# Altium schematic sheet power_supply_v2.SchDoc
size A
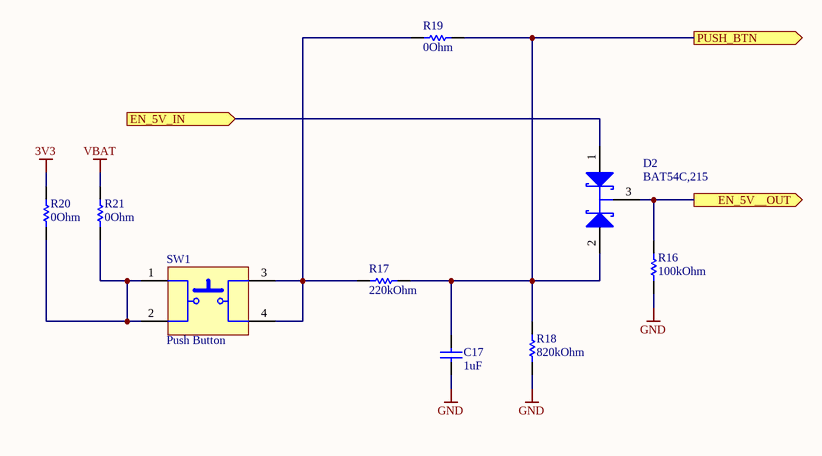
[diagram p0: power_supply_v2.SchDoc]

## Parts
C17  1uF  [CAP_0804]
D2  BAT54C,215  [SOT23]
R16  100kOhm  [RES_0804]
R17  220kOhm  [RES_0804]
R18  820kOhm  [RES_0804]
R19  0Ohm  [RES_0804]
R20  0Ohm  [RES_0804]
R21  0Ohm  [RES_0804]
SW1  Push Button  [SWITCH]

## Ports
EN_5V__OUT (out), EN_5V_IN (in), PUSH_BTN (out)

## Nets
3V3: R20.2
GND: C17.1 R16.1 R18.1
VBAT: R21.2
EN_5V__OUT: D2.3(K) R16.2 ; port EN_5V__OUT
EN_5V_IN: D2.1(A) ; port EN_5V_IN
PUSH_BTN: C17.2 D2.2(A) R17.2 R18.2 R19.2 ; port PUSH_BTN
NetR17_1: R17.1 R19.1 SW1.3 SW1.4
NetR20_1: R20.1 R21.1 SW1.1 SW1.2

## Library data of the parts
C17 = CAP_1UF: PartNumber: 1206GC102KAT1A; Manufacturer: AVX; Capacitance: 0.001uF; Dielectric: X7R; Tolerance: 10%; Tolerance (%): ±10%; Voltage Rating DC: 2000V; Package Reference: 1206; Datasheet Version: 11/2010; Mounting Technology: SurfaceMount; Manufacturer URL: http://www.avx.com/; Datasheet URL: https://datasheet.ciiva.com/11787/0900766b80ed4c37-11787781.pdf; Package Description: 2-Pin SMD, Body 3.4 x 1.8 mm; Case Size/Dimension: 1206; Rated Voltage: 2000V
D2 = DIODE_BAT54C: Schottky Barrier Diode, 30 V, 3-Pin SOT23, RoHS, Tape and Reel; Manufacturer: NXP Semiconductors; Forward Surge Current Ifsm Max: 600mA; Pin Configuration: 1A1,2A2,3comK; Package Version: Feb-16; Forward Voltage VF Max: 800mV; SMD Marking: L43/*W1; Diode Case Style: SOT-23; Reverse Recovery Time trr Typ: 5ns; Forward Current If(AV): 200mA; Reel Quantity: 3000; SVHC: NoSVHC(19-Dec-2012); No. of Pins: 3; Junction Temperature Tj Max: 125degC; Common Connection: Cathode; Repetitive Reverse Voltage Vrrm Max: 30V; Operating Temperature Max: 150degC; Operating Temperature Range: -65degCto+150degC; Termination Type: SMD; Package Description: 3-Pin Small Outline Transistor, Body 1.3 x 2.9 mm, Pitch 0.95 mm; Package / Case: SOT-23; Diode Type: Schottky; Manufacturer URL: http://www.nxp.com/; Tape Width: 8mm; Package Reference: SOT23-3; Datasheet URL: https://datasheet.ciiva.com/33723/1668625-33723936.pdf; Datasheet Version: Rev. 5 , 10/2012; Operating Temperature Min: -65degC; Current Ifsm: 600mA; Reverse Recovery Time trr Max: 5ns; Package URL: http://www.nxp.com/documents/outline_drawing/SOT23.pdf; Forward Voltage: 800mV
R16 = RES_100K: Part Number: CRCW120647K0FKEA; Manufacturer: Vishay Dale
R17 = RES_220K: Part Number: CRCW120647K0FKEA; Manufacturer: Vishay Dale
R18 = RES_820K: Part Number: CRCW120647K0FKEA; Manufacturer: Vishay Dale
R19-R21 = RES_0R: Part Number: CRCW120647K0FKEA; Manufacturer: Vishay Dale
SW1 = SWITCH: Micro Miniature Push Button Switch FSM JSM, 50 mA, -35 to 85 degC, 4-Pin SMD, RoHS, Tape and Reel; Manufacturer: TE Connectivity; Mechanical Life: 100000Cycles; Current Rating: 50mA; Actuator Material: Polyamide; Max Voltage Rating (DC): 12V; Capacitance: 0f; Illumination Type: Illuminated; Voltage Rating (DC): 24V; Case\/Package: SMD/SMT; Operating Force: 160gf; Contact Resistance: 100mOhm; Actuator Length: 0.055inch; Switch Travel: 0.25mm; Throw Configuration: SPST; Termination: GullWing; Contact Plating: Silver; Orientation: Straight; Mounting Technology: SurfaceMount; REACH SVHC: Unknown; Electrical Life: 100000Cycles; Package Reference: FSM4JSMATR; Max Operating Temperature: 85degC; Manufacturer URL: http://www.te.com/; Package Description: 4-Pin Surface Mount Device, Body 6 x 6 mm, Pitch 4.5 mm; Datasheet Version: Rev. V, 02/2015; Packaging: TapeandReel; Min Operating Temperature: -35degC; Mount: SurfaceMount; Contact Current Rating: 50mA; Contact Material: CopperAlloy; Package Quantity: 1200; Datasheet URL: http://www.te.com/commerce/DocumentDelivery/DDEController?Action=showdoc&DocId=Customer+Drawing%7F2-1437565-7%7FV%7Fpdf%7FEnglish%7FENG_CD_2-1437565-7_V.pdf%7F4-1437565-2; RoHSCompliant: true